# EAGLE design R3Mkr12F_Solar (EAGLE 9.0.1)
CREV: 0.9

## Sheet 1 of 2
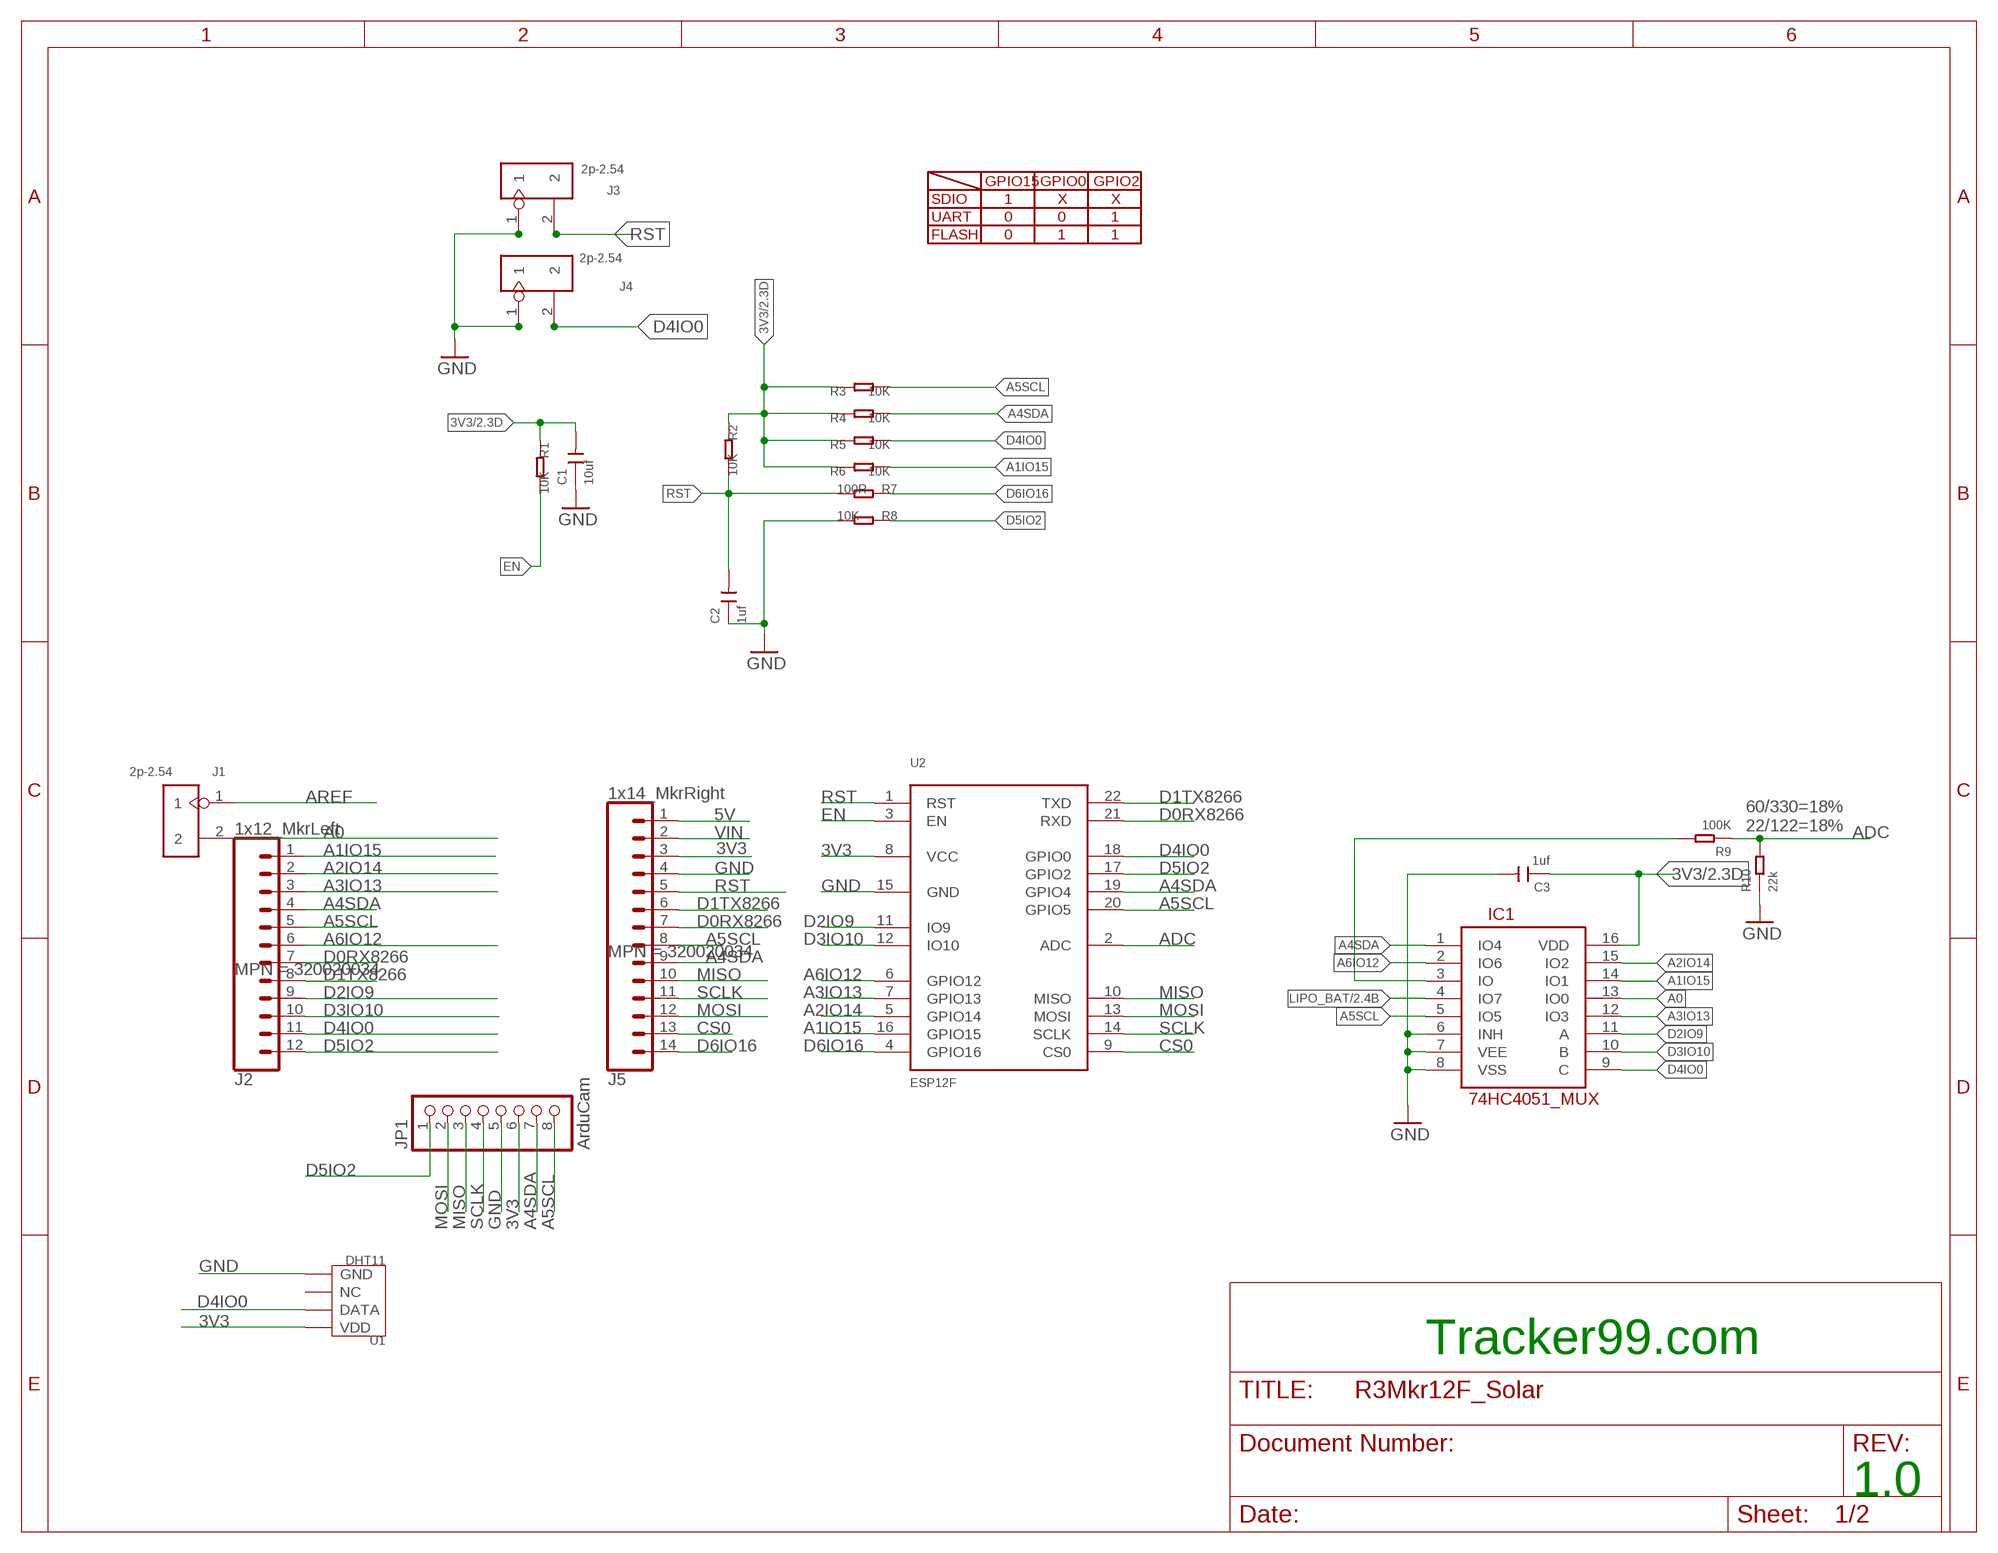
[diagram p0: schematic, sheet 1]
FRAME1 (FRAME_A_L): AUTHOR: jimmy; CREV: 1; DOC_NUMBER: 111; REVISION: 1.0

### Parts
C1  10uf  CERAMIC-10UF-10V-10%-X5R(0603)  [C0603]
C2  1uf  CERAMIC-1UF-25V-10%-X7R(0603)  [C0603]
C3  1uf  CERAMIC-1UF-25V-10%-X7R(0603)  [C0603]
IC1  74HC4051_MUX  SPARKFUN_74HC4051_MUX  [SPARKFUN_SO16]
J1  2p-2.54  DIP-BLACK-ROUND-FEMALE-HEADER-VERT(2P-2.54)  [H2-2.54]
J2  1x12_MkrLeft  CONN_12LOCK  [1X12_LOCK]
J3  2p-2.54  DIP-BLACK-MALE-HEADER-VERT(2P-2.54)  [H2-2.54]
J4  2p-2.54  DIP-BLACK-MALE-HEADER-VERT(2P-2.54)  [H2-2.54]
J5  1x14_MkrRight  CONN_14LOCK  [1X14_LOCK]
JP1  ArduCam  MILLER_PINHD-1X8LOCK  [MILLER_1X08-LOCK]
R1  10K  SEEED-RESISTOR_SMD-RES-10K-5%-1/(0402)  [SEEED-RESISTOR_R0402]
R2  10K  SEEED-RESISTOR_SMD-RES-10K-5%-1/(0402)  [SEEED-RESISTOR_R0402]
R3  10K  SEEED-RESISTOR_SMD-RES-10K-5%-1/(0402)  [SEEED-RESISTOR_R0402]
R4  10K  SEEED-RESISTOR_SMD-RES-10K-5%-1/(0402)  [SEEED-RESISTOR_R0402]
R5  10K  SEEED-RESISTOR_SMD-RES-10K-5%-1/(0402)  [SEEED-RESISTOR_R0402]
R6  10K  SEEED-RESISTOR_SMD-RES-10K-5%-1/(0402)  [SEEED-RESISTOR_R0402]
R7  100R  SMD-RES-100R-5%-1/10W(0603)  [R0603]
R8  10K  SEEED-RESISTOR_SMD-RES-10K-5%-1/(0402)  [SEEED-RESISTOR_R0402]
R9  100K  SMD-RES-100K-1%-1/16W(0402)  [R0402]
R10  22k  SMD-RES-22K-1%-1/16W(0402)  [R0402]
U1  DHT11  TEM-HUM-DHT11(4P-15.5X12.0MM)  [SNR4-2.54-15.5X12.0X5.5MM]
U2  ESP12F  ESP-12F  [ESP-12F]

### Nets
3V3 [POWER]: C1.2 C3.1 IC1.16(VDD) J5.3 JP1.6 R1.1 R2.1 R3.1 R4.1 R5.1 R6.1 U1.1(VDD) U2.8(VCC) ; also sheet 2
5V [POWER]: J5.1 ; also sheet 2
A0: IC1.13(IO0) J1.2
A1IO15: IC1.14(IO1) J2.1 R6.2 U2.16(GPIO15)
A2IO14: IC1.15(IO2) J2.2 U2.5(GPIO14)
A3IO13: IC1.12(IO3) J2.3 U2.7(GPIO13)
A4SDA: IC1.1(IO4) J2.4 J5.9 JP1.7 R4.2 U2.19(GPIO4)
A5SCL: IC1.5(IO5) J2.5 J5.8 JP1.8 R3.2 U2.20(GPIO5)
A6IO12: IC1.2(IO6) J2.6 U2.6(GPIO12)
ADC: R9.1 R10.2 U2.2(ADC)
AREF: J1.1
CS0: J5.13 U2.9(CS0)
D0RX8266: J2.7 J5.7 U2.21(RXD)
D1TX8266: J2.8 J5.6 U2.22(TXD)
D2IO9: IC1.11(A) J2.9 U2.11(IO9)
D3IO10: IC1.10(B) J2.10 U2.12(IO10)
D4IO0: IC1.9(C) J2.11 J4.2 R5.2 U1.2(DATA) U2.18(GPIO0)
D5IO2: J2.12 JP1.1 R8.1 U2.17(GPIO2)
D6IO16: J5.14 R7.1 U2.4(GPIO16)
EN: R1.2 U2.3(EN)
GND [POWER]: C1.1 C2.1 C3.2 IC1.6(INH) IC1.7(VEE) IC1.8(VSS) J3.1 J4.1 J5.4 JP1.5 R8.2 R10.1 U1.4(GND) U2.15(GND) ; also sheet 2
LIPO_BAT [POWER]: IC1.4(IO7) ; also sheet 2
MISO: J5.10 JP1.3 U2.10(MISO)
MOSI: J5.12 JP1.2 U2.13(MOSI)
RST: C2.2 J3.2 J5.5 R2.2 R7.2 U2.1(RST)
SCLK: J5.11 JP1.4 U2.14(SCLK)
VIN: J5.2
Z: IC1.3(IO) R9.2
Unconnected: U1.3(NC)

### Notes on the sheet
- GPIO15 | GPIO0 | GPIO2
- SDIO | 1 | X | X
- UART | 0 | 0 | 1
- FLASH | 0 | 1 | 1
- 60/330=18%
  22/122=18%
- Tracker99.com
- 1.0

## Sheet 2 of 2
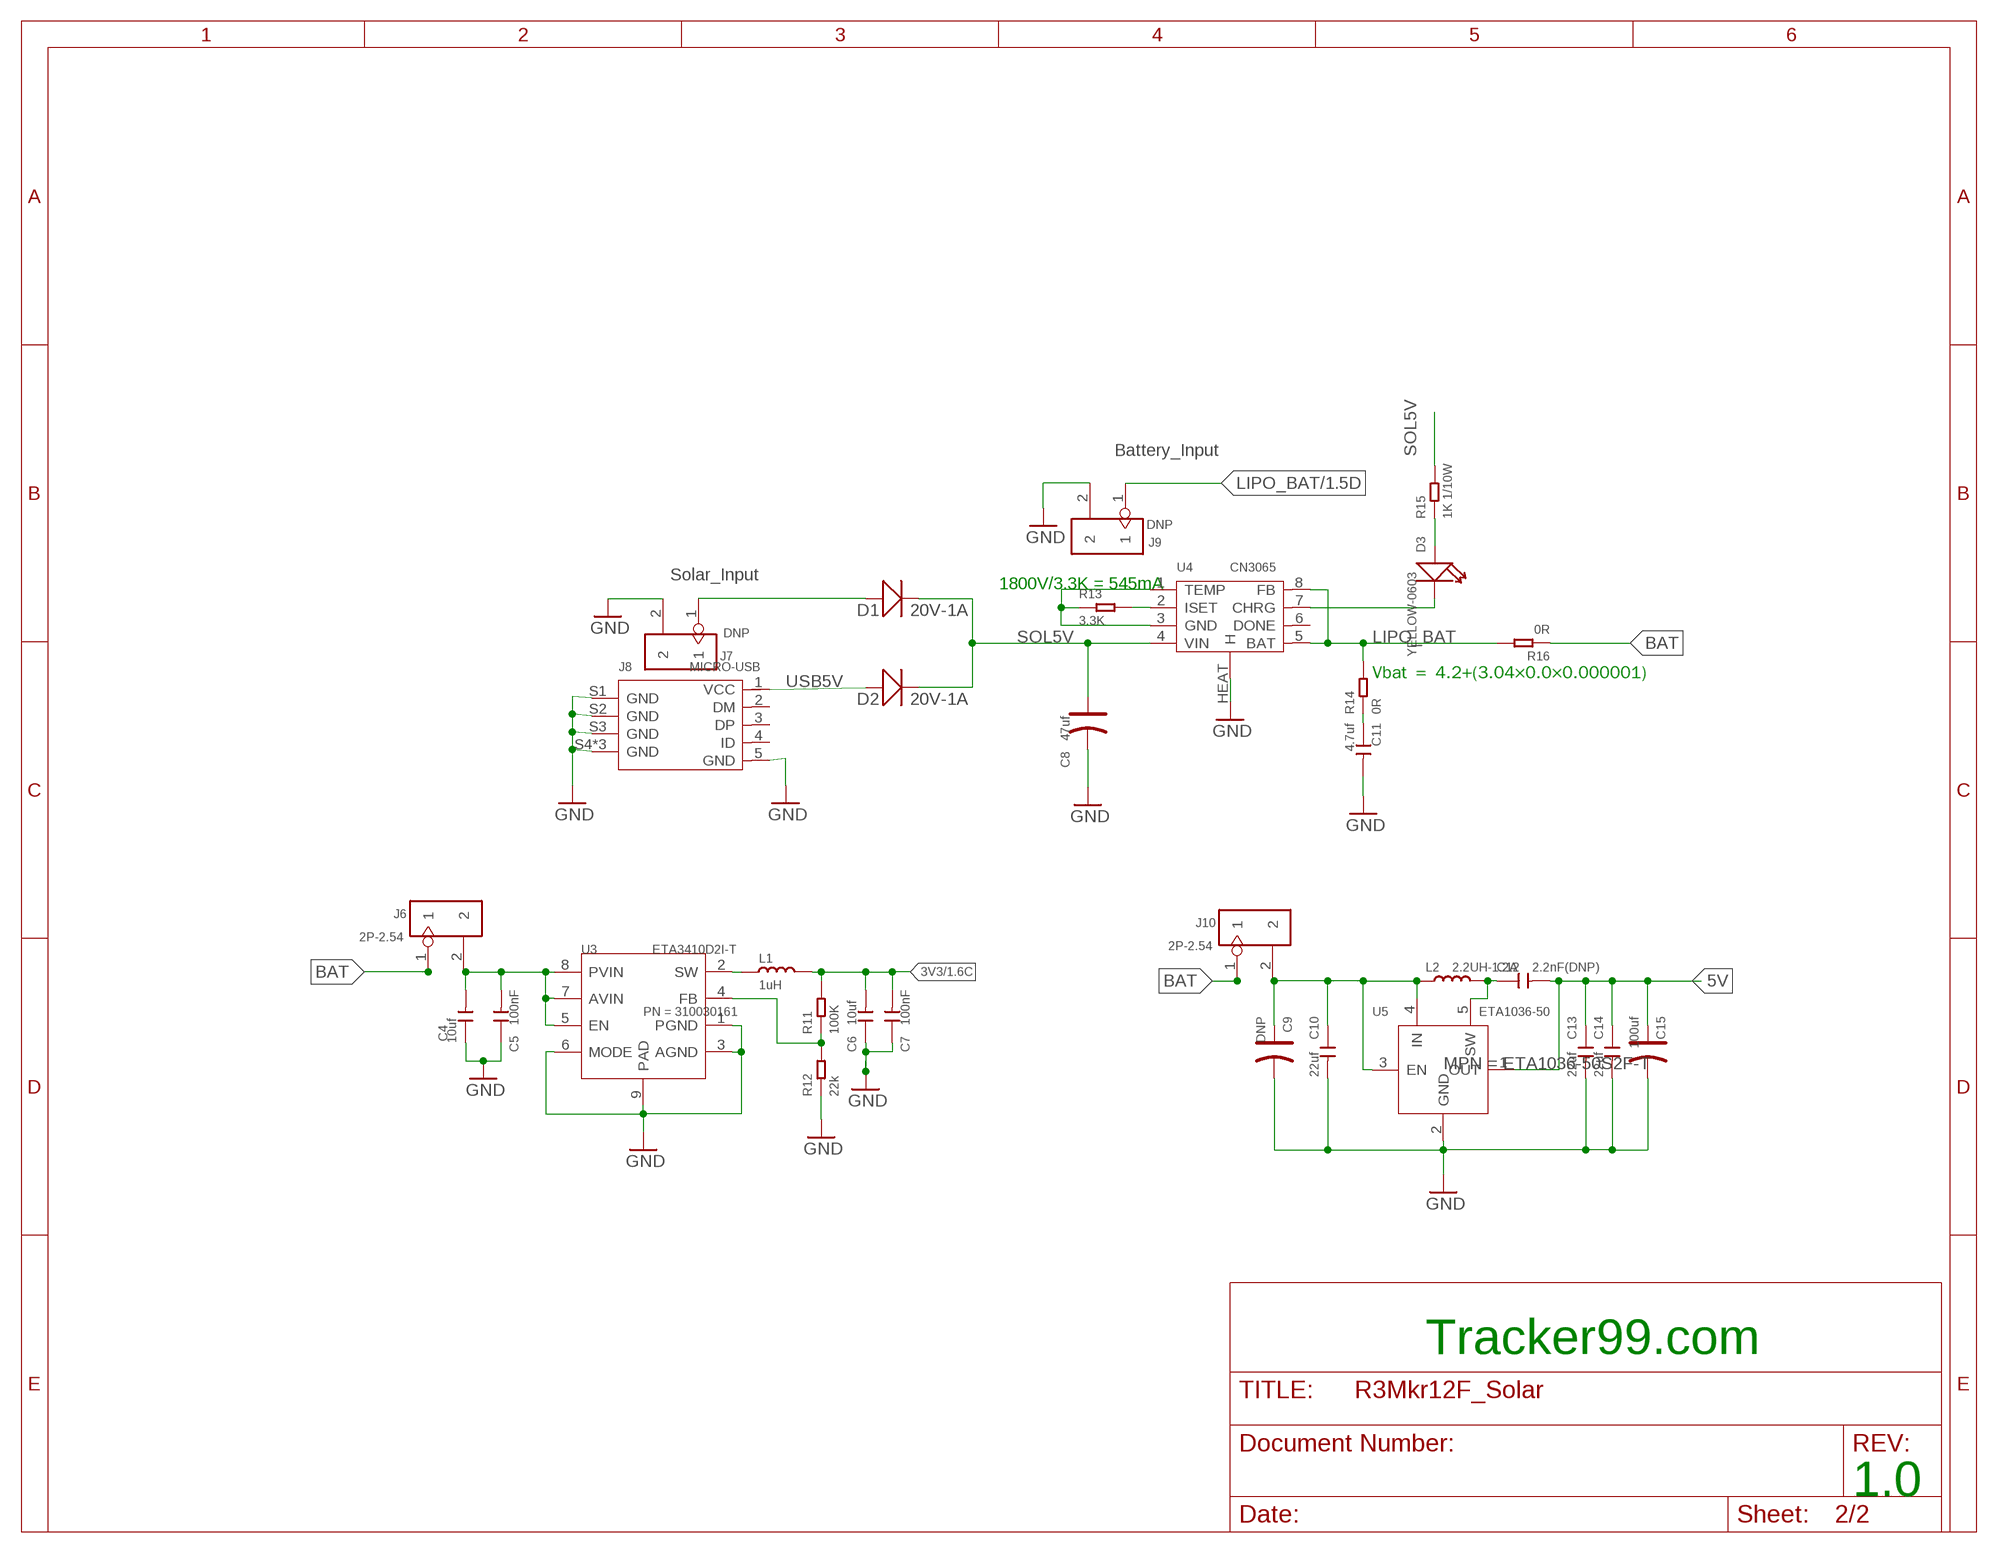
[diagram p1: schematic, sheet 2]

### Parts
C4  10uf  CERAMIC-10UF-25V-10%-X5R(0805)  [C0805]
C5  100nF  CAP-0402  [C0402]
C6  10uf  CERAMIC-10UF-25V-10%-X5R(0805)  [C0805]
C7  100nF  CAP-0402  [C0402]
C8  47uf  TANTALUM-SMD-47UF-6.3V(AVX-A)  [AVX-A]
C9  DNP  CAP_AVX_B  [AVX-B]
C10  22uf  CERAMIC-22UF-6.3V-20%-X5R(0805)  [C0805]
C11  4.7uf  CERAMIC-4.7UF-10V-10%-X5R(0603)  [C0603]
C12  2.2nF(DNP)  C-0603  [C0603]
C13  22uf  CERAMIC-22UF-6.3V-20%-X5R(0805)  [C0805]
C14  22uf  CERAMIC-22UF-6.3V-20%-X5R(0805)  [C0805]
C15  100uf  TANTALUM-SMD-100UF-10V(AVX-B)  [AVX-B]
D1  20V-1A  SMD-DIODE-SCHOTTKY-20V-1A(SOD-123)  [SOD-123]
D2  20V-1A  SMD-DIODE-SCHOTTKY-20V-1A(SOD-123)  [SOD-123]
D3  YELLOW-0603  SMD-LED-CLEAR-YELLOW(0603)  [LED-0603]
J6  2P-2.54  DIP-WHITE-MALE-HEADER-VERT(2P-2.54)  [H2-2.54]
J7  DNP  DIP-WHITE-MALE-HEADER-VERT(2P-2.54)  [H2-2.54]
J8  MICRO-USB  MICRO-USB5+4P'5+4P'  [MICRO-USB5+4P-SMD-0.65-B]
J9  DNP  DIP-WHITE-MALE-HEADER-VERT(2P-2.54)  [H2-2.54]
J10  2P-2.54  DIP-WHITE-MALE-HEADER-VERT(2P-2.54)  [H2-2.54]
L1  1uH  INDUCTOR/FERRITE-BEAD'0603'  [L0603]
L2  2.2UH-1.2A  SMD-INDUCTOR-2.2UH-20%-1.2A(0805)  [L0805]
R11  100K  SMD-RES-100K-1%-1/16W(0402)  [R0402]
R12  22k  SMD-RES-22K-1%-1/16W(0402)  [R0402]
R13  3.3K  SMD-RES-3.3K-5%-1/10W(0603)  [R0603]
R14  0R  SMD-RES-0R-5%-1/10W(0603)  [R0603]
R15  1K 1/10W  SMD-RES-1K-5%-1/10W(0603)  [R0603]
R16  0R  SMD-RES-0R-5%-1/10W(0603)  [R0603]
U3  ETA3410D2I-T  CONVERTER-ETA3410  [DFN8G-0.5-2X2MM]
U4  CN3065  PMIC-CN3065-DFN8  [DFN-8]
U5  ETA1036-50  ETA1036  [SOT23-5]

### Nets
3V3 [POWER]: C6.2 C7.2 L1.2 R11.2 ; also sheet 1
5V [POWER]: C12.2 C13.1 C14.1 C15.+ U5.1(OUT) ; also sheet 1
BAT [POWER]: J6.1 J10.1 R16.1
BAT_3V3_IN [POWER]: C4.2 C5.2 J6.2 U3.5(EN) U3.7(AVIN) U3.8(PVIN)
BAT_IN [POWER]: C9.+ C10.1 J10.2 L2.1 U5.3(EN) U5.4(IN)
GND [POWER]: C4.1 C5.1 C6.1 C7.1 C8.- C9.- C10.2 C11.2 C13.2 C14.2 C15.- J7.2 J8.5(GND) J8.S1(GND) J8.S2(GND) J8.S3(GND) J8.S4(GND) J8.S5(GND) J8.S6(GND) J9.2 R12.1 R13.1 U3.1(PGND) U3.3(AGND) U3.6(MODE) U3.9(PAD) U4.1(TEMP) U4.3(GND) U4.HEAT(H) U5.2(GND) ; also sheet 1
LIPO_BAT [POWER]: J9.1 R14.2 R16.2 U4.5(BAT) U4.8(FB) ; also sheet 1
N$1 [POWER]: D1.+ J7.1
N$2: D3.+ R15.1
N$3: L1.1 U3.2(SW)
N$4: R11.1 R12.2 U3.4(FB)
N$7: R13.2 U4.2(ISET)
N$8: D3.- U4.7(CHRG)
N$10: C11.1 R14.1
N$11: C12.1 L2.2 U5.5(SW)
SOL5V [POWER]: C8.+ D1.- D2.- R15.2 U4.4(VIN)
USB5V [VUSB]: D2.+ J8.1(VCC)
Unconnected: J8.2(DM) J8.3(DP) J8.4(ID) U4.6(DONE)

### Notes on the sheet
- Battery_Input
- Solar_Input
- 1800V/3.3K = 545mA
- Vbat ＝ 4.2+(3.04×0.0×0.000001)
- Tracker99.com
- 1.0

## Library data of the parts
C1 = Seeed-Capacitor:CERAMIC-10UF-10V-10%-X5R(0603): 302010103; MPN: CC0603KRX5R6BB106
C2 C3 = Seeed-Capacitor:CERAMIC-1UF-25V-10%-X7R(0603): 302010139; MPN: CC0603KRX7R8BB105
C4 C6 = Seeed-Capacitor:CERAMIC-10UF-25V-10%-X5R(0805): 302010178; MPN: CC0805KKX5R8BB106; PN: 302010178
C5 C7 = Discrete-new:CAP: Ceramic Capacitors; PN: 302010004
C8 = Seeed-Capacitor:TANTALUM-SMD-47UF-6.3V(AVX-A): 302020005; MPN: TAJA476*006#NJ
C9 = discrete:CAP*: Electrolytic Capacitors,Tantalum Capacitors and Super Capacitors
C10 C13 C14 = Seeed-Capacitor:CERAMIC-22UF-6.3V-20%-X5R(0805): 302010171; MPN: CC0805MKX5R5BB226
C11 = Seeed-Capacitor:CERAMIC-4.7UF-10V-10%-X5R(0603): 302010111; MPN: CC0603KRX5R6BB475
C12 = discrete:C*: Ceramic Capacitors
C15 = Seeed-Capacitor:TANTALUM-SMD-100UF-10V(AVX-B): 302020015; MPN: TAJB107M010#NJ
D1 D2 = Seeed-OPL-2017-01-Diode-james:SMD-DIODE-SCHOTTKY-20V-1A(SOD-123): 304020034; MPN: B5819W
D3 = Seeed-LED:SMD-LED-CLEAR-YELLOW(0603): 304090044; MPN: 19-217-Y5C-AM1N1VY-3T
IC1 = Mkr4_12F:SPARKFUN_74HC4051_MUX
J1 = Seeed-Connector:DIP-BLACK-ROUND-FEMALE-HEADER-VERT(2P-2.54): 320030050; MPN: RF130-1023ABS0741
J2 = SparkFun-Connectors:CONN_12: Multi connection point. Often used as Generic Header-pin footprint for 0.1 inch spaced/style header connections On any of the 0.1 inch spaced packages, you can populate with these: Break Away Headers - Straight <https://www.sparkfun.com/products/116> (PRT-00116) Break Away Male Headers - Right Angle <https://www.sparkfun.com/products/553> (PRT-00553) Female Headers <https://www.sparkfun.com/products/115> (PRT-00115) Break Away Headers - Machine Pin <https://www.sparkfun.com/products/117> (PRT-00117) Break Away Female Headers - Swiss Machine Pin <https://www.sparkfun.com/products/743> (PRT-00743) For SCREWTERMINALS and SPRING TERMINALS visit here: Screw Terimnals on SparkFun.com <https://www.sparkfun.com/search/results?term=Screw+Terminals> (5mm/3.5mm/2.54mm spacing) This device is also useful as a general connection point to wire up your design to another part of your project. Our various solder wires solder well into these plated through hole pads. Hook-Up Wire - Assortment (Stranded, 22 AWG) <https://www.sparkfun.com/products/11375> (PRT-11375) Hook-Up Wire - Assortment (Solid Core, 22 AWG) <https://www.sparkfun.com/products/11367> (PRT-11367) View the entire wire category on our website here <https://www.sparkfun.com/categories/141> Special notes: Molex polarized connector foot print use with SKU : PRT-08231 with associated crimp pins and housings. 1MM SMD Version SKU: PRT-10208 NOTES ON THE VARIANTS LOCK and LOCK_LONGPADS... This footprint was designed to help hold the alignment of a through-hole component (i.e. 6-pin header) while soldering it into place. You may notice that each hole has been shifted either up or down by 0.005 of an inch from it's more standard position (which is a perfectly straight line). This slight alteration caused the pins (the squares in the middle) to touch the edges of the holes. Because they are alternating, it causes a "brace" to hold the component in place. 0.005 has proven to be the perfect amount of "off-center" position when using our standard breakaway headers. Although looks a little odd when you look at the bare footprint, once you have a header in there, the alteration is very hard to notice. Also,if you push a header all the way into place, it is covered up entirely on the bottom side.; MPN: 320020034
J3 J4 = Seeed-Connector:DIP-BLACK-MALE-HEADER-VERT(2P-2.54): 320020016; MPN: P125-1102A0BS116A1
J5 = SparkFun-Connectors:CONN_14: Multi connection point. Often used as Generic Header-pin footprint for 0.1 inch spaced/style header connections On any of the 0.1 inch spaced packages, you can populate with these: Break Away Headers - Straight <https://www.sparkfun.com/products/116> (PRT-00116) Break Away Male Headers - Right Angle <https://www.sparkfun.com/products/553> (PRT-00553) Female Headers <https://www.sparkfun.com/products/115> (PRT-00115) Break Away Headers - Machine Pin <https://www.sparkfun.com/products/117> (PRT-00117) Break Away Female Headers - Swiss Machine Pin <https://www.sparkfun.com/products/743> (PRT-00743) For SCREWTERMINALS and SPRING TERMINALS visit here: Screw Terimnals on SparkFun.com <https://www.sparkfun.com/search/results?term=Screw+Terminals> (5mm/3.5mm/2.54mm spacing) This device is also useful as a general connection point to wire up your design to another part of your project. Our various solder wires solder well into these plated through hole pads. Hook-Up Wire - Assortment (Stranded, 22 AWG) <https://www.sparkfun.com/products/11375> (PRT-11375) Hook-Up Wire - Assortment (Solid Core, 22 AWG) <https://www.sparkfun.com/products/11367> (PRT-11367) View the entire wire category on our website here <https://www.sparkfun.com/categories/141> Special notes: Molex polarized connector foot print use with SKU : PRT-08231 with associated crimp pins and housings. 1MM SMD Version SKU: PRT-10208 NOTES ON THE VARIANTS LOCK and LOCK_LONGPADS... This footprint was designed to help hold the alignment of a through-hole component (i.e. 6-pin header) while soldering it into place. You may notice that each hole has been shifted either up or down by 0.005 of an inch from it's more standard position (which is a perfectly straight line). This slight alteration caused the pins (the squares in the middle) to touch the edges of the holes. Because they are alternating, it causes a "brace" to hold the component in place. 0.005 has proven to be the perfect amount of "off-center" position when using our standard breakaway headers. Although looks a little odd when you look at the bare footprint, once you have a header in there, the alteration is very hard to notice. Also,if you push a header all the way into place, it is covered up entirely on the bottom side.; MPN: 320020034
J6 J10 = Seeed-Connector:DIP-WHITE-MALE-HEADER-VERT(2P-2.54): 320020037; MPN: P125-1102A0BS116A3
J7 J9 = Seeed-Connector:DIP-WHITE-MALE-HEADER-VERT(2P-2.54): 320020037; MPN: P125-1102A0BS116A3; VALUE: 2P-2.54
J8 = Connector-new:MICRO-USB5+4P: 5+4P-SMD-0.65-B:320010000;5+2P-SMD-0.65-AB:340032001; EAGLEUP: USB-MICROB;2.54mm
JP1 = MKR12FUNO99:MILLER_PINHD-1X8: PIN HEADER
L1 = Discrete-new:INDUCTOR/FERRITE-BEAD; PN: 303010110
L2 = Seeed-Inductor:SMD-INDUCTOR-2.2UH-20%-1.2A(0805): 303010086; MPN: LQM2MPN2R2MG0
R1-R6 R8 = R3Mkr12F_Solar:SEEED-RESISTOR_SMD-RES-10K-5%-1/(0402): 301010004; MPN: RC0402JR-0710KL
R7 = Seeed-Resistor:SMD-RES-100R-5%-1/10W(0603): 301010090; MPN: RC0603JR-07100RL
R9 R11 = Seeed-Resistor:SMD-RES-100K-1%-1/16W(0402): 301010456; MPN: RC0402FR-07100KL; PN: 301010666
R10 R12 = Seeed-Resistor:SMD-RES-22K-1%-1/16W(0402); MPN: RC0402FR-0722KL
R13 = Seeed-Resistor:SMD-RES-3.3K-5%-1/10W(0603): 301010112
R14 R16 = Seeed-Resistor:SMD-RES-0R-5%-1/10W(0603): 301010292; MPN: RC0603JR-070RL
R15 = Seeed-Resistor:SMD-RES-1K-5%-1/10W(0603): 301010291; MPN: RC0603JR-071KL
U1 = Seeed-Sensor:TEM-HUM-DHT11(4P-15.5X12.0MM): 314010000; MPN: DHT11
U2 = Seeed-OPL-2017-01-Sensor-camilo:ESP-12F: 317060163
U3 = template:CONVERTER-ETA3410: 3MHZ 2A High Step-Down Converter in DFN2x2-8L Package; PN: 310030161
U4 = IC-new:PMIC-CN3065: 310030101
U5 = IC:ETA1036; MPN: ETA1036-50S2F-T

## Net classes
0 default: width 0.152 mm, drill 0.152 mm, clearance 0.152 mm
1 POWER: width 0.305 mm, clearance 0.152 mm
2 VUSB: width 0.305 mm, drill 0.254 mm, clearance 0.203 mm

## Board
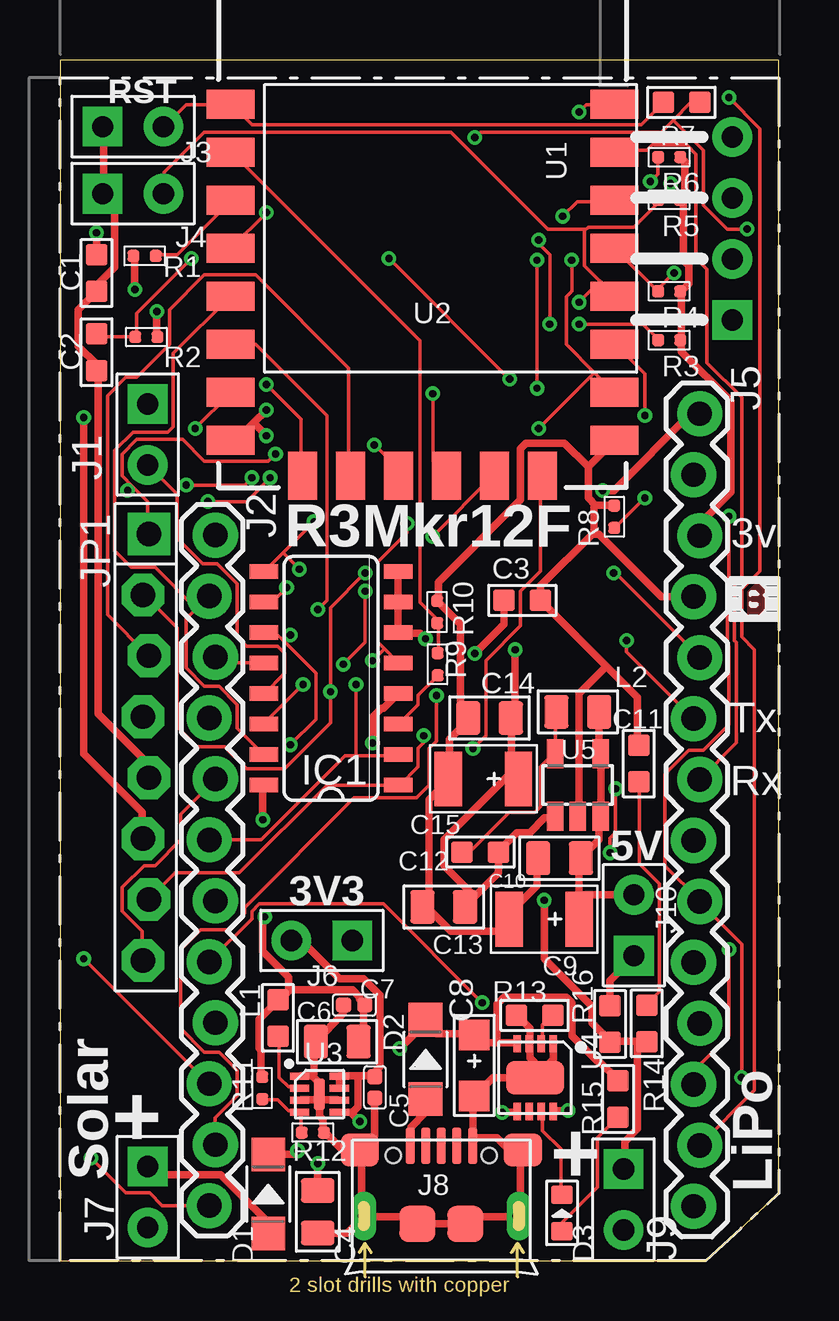
[diagram p2: board, top side]
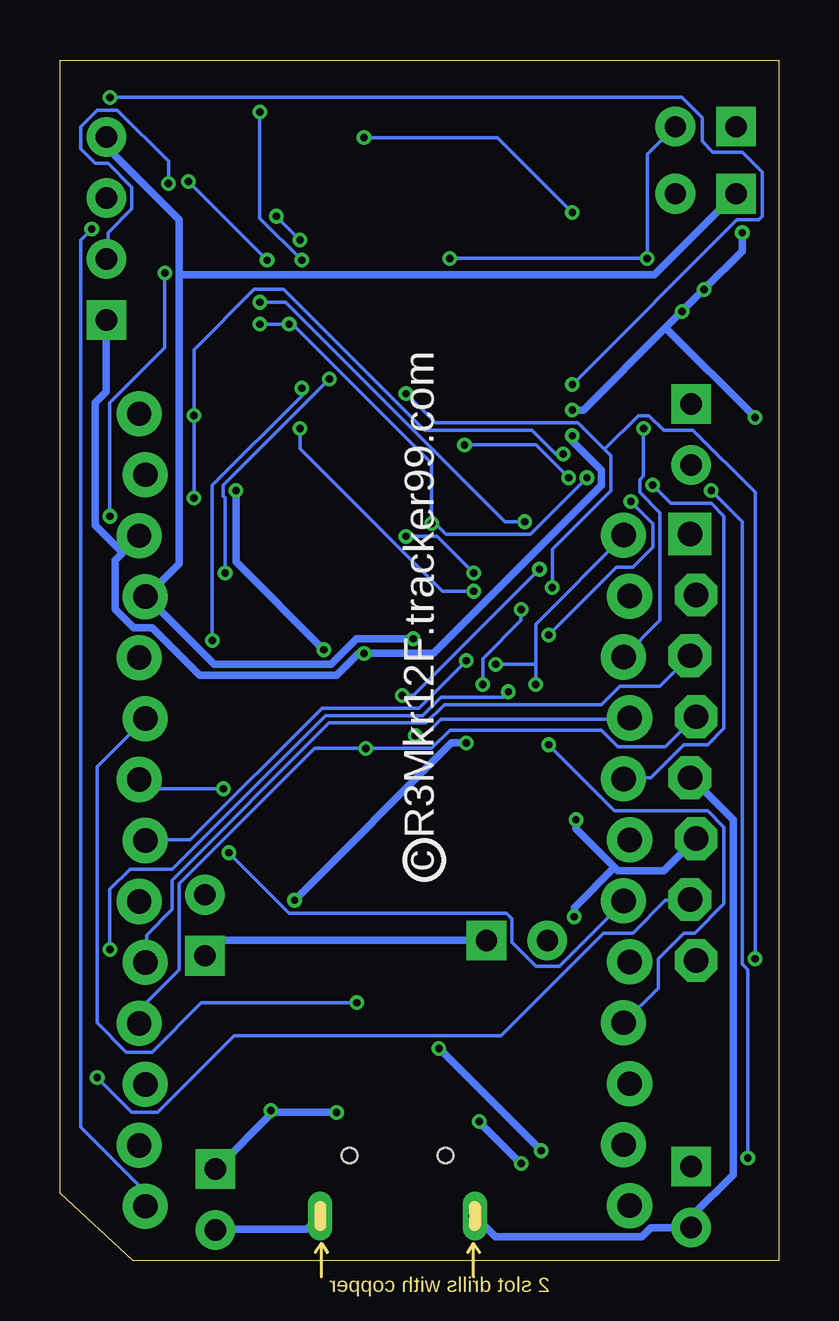
[diagram p3: board, bottom side, seen from below]

Size 29.97 x 50.02 mm. Coordinates in mm from the lower left corner, seen from the top.
Outline: 29.97,50.02 0,50.02 0,0 26.92,0 29.97,2.79 29.97,50.02
Copper layers (1*16): Top 0.035mm / dielectric 1.5mm / Bottom 0.035mm
Design rules "SeeedStudio_2layer_DRU_no_angle_20140221 *": minimum track width 6mil, minimum drill 12mil, track to track 6mil, track to pad 6mil, pad to pad 6mil, via to via 6mil, smd to smd 0mil, copper to edge 10mil, drill to drill 10mil, minimum pad ring 6mil, minimum via ring 6mil, stop-mask expansion 2mil, vias tented up to drill 100mil, thermal gap 10mil
tRestrict: area 29.5,1.3 to 30.7,50.8; area -0.5,-1 to 0.5,49.8
bRestrict: area 29.2,0 to 30.5,49.5; area -1,-0.5 to 0.5,50.3

### Footprints (pad centres in the part's own frame; a part is rotated, then mirrored left to right if it is on the bottom)
C0603 = smd 0.889 x 0.889: 1 0,0.762; 2 0,-0.762
C0805 = smd 1.397 x 1.016: 1 0,0.889; 2 0,-0.889
C0402 = smd 0.635 x 0.635: 1 0,0.445; 2 0,-0.445
AVX-A = smd 1.27 x 1.27: + -1.27,0; - 1.27,0
AVX-B = smd 1.143 x 2.286: + -1.46,0; - 1.46,0
C0603' = smd 0.889 x 0.889: 1 -0.762,0; 2 0.762,0
SOD-123 = smd 1.397 x 1.397: + -1.651,0; - 1.651,0
LED-0603 = smd 0.762 x 0.889: + -0.762,0; - 0.762,0
SPARKFUN_SO16 = smd 0.6 x 1.2: 1 -4.445,-2.8; 2 -3.175,-2.8; 3 -1.905,-2.8; 4 -0.635,-2.8; 5 0.635,-2.8; 6 1.905,-2.8; 7 3.175,-2.8; 8 4.445,-2.8; 9 4.445,2.8; 10 3.175,2.8; 11 1.905,2.8; 12 0.635,2.8; 13 -0.635,2.8; 14 -1.905,2.8; 15 -3.175,2.8; 16 -4.445,2.8
H2-2.54 = drill 0.889 pad 1.651 square: 1 0,1.27 | drill 0.889 pad 1.651: 2 0,-1.27
1X12_LOCK = drill 1.016 pad 1.88: 1 0,0.127; 2 2.54,-0.127; 3 5.08,0.127; 4 7.62,-0.127; 5 10.16,0.127; 6 12.7,-0.127; 7 15.24,0.127; 8 17.78,-0.127; 9 20.32,0.127; 10 22.86,-0.127; 11 25.4,0.127; 12 27.94,-0.127
1X14_LOCK = drill 1.016 pad 1.88: 1 0,0.127; 2 2.54,-0.127; 3 5.08,0.127; 4 7.62,-0.127; 5 10.16,0.127; 6 12.7,-0.127; 7 15.24,0.127; 8 17.78,-0.127; 9 20.32,0.127; 10 22.86,-0.127; 11 25.4,0.127; 12 27.94,-0.127; 13 30.48,0.127; 14 33.02,-0.127
MICRO-USB5+4P-SMD-0.65-B = smd 0.381 x 1.524: 1 -1.3,-0.25; 2 -0.65,-0.25; 3 0,-0.25; 4 0.65,-0.25; 5 1.3,-0.25 | smd 1.6 x 1.397: S1 -3.4,-0.427; S6 3.4,-0.427 | drill 0.508 pad 1.016 long: S2 -3.226,-3.175; S5 3.226,-3.175 | smd 1.5 x 1.5: S3 -1,-3.5; S4 1,-3.5 | hole 0.635: -2,-0.65; 2,-0.65
MILLER_1X08-LOCK = drill 1.016 pad 1.778 square: 1 -8.89,0.127 | drill 1.016 pad 1.778 octagon: 2 -6.35,-0.127; 3 -3.81,0.127; 4 -1.27,-0.127; 5 1.27,0.127; 6 3.81,-0.127; 7 6.35,0.127; 8 8.89,-0.127
L0603 = smd 0.889 x 0.889: 1 -0.762,0; 2 0.762,0
L0805 = smd 1.016 x 1.397: 1 -0.889,0; 2 0.889,0
SEEED-RESISTOR_R0402 = smd 0.5 x 0.5: 1 0,0.463; 2 0,-0.463
R0603 = smd 0.889 x 0.889: 1 0,0.762; 2 0,-0.762
R0402 = smd 0.5 x 0.5: 1 0,0.463; 2 0,-0.463
SNR4-2.54-15.5X12.0X5.5MM = drill 0.889 pad 1.651 square: 1 -11.75,3.81 | drill 0.889 pad 1.651: 2 -11.75,1.27; 3 -11.75,-1.27; 4 -11.75,-3.81
ESP-12F = smd 2 x 1.2: 1 -8,3.48; 2 -8,1.48; 3 -8,-0.52; 4 -8,-2.52; 5 -8,-4.52; 6 -8,-6.52; 7 -8,-8.52; 8 -8,-10.52; 15 8,-10.52; 16 8,-8.52; 17 8,-6.52; 18 8,-4.52; 19 8,-2.52; 20 8,-0.52; 21 8,1.48; 22 8,3.48 | smd 1.2 x 2: 9 -5,-12; 10 -3,-12; 11 -1,-12; 12 1,-12; 13 3,-12; 14 5,-12
DFN8G-0.5-2X2MM = smd 0.8 x 0.3: 1 -0.827,0.75; 2 -0.827,0.25; 3 -0.827,-0.25; 4 -0.827,-0.75; 5 0.827,-0.75; 6 0.827,-0.25; 7 0.827,0.25; 8 0.827,0.75 | smd 0.45 x 1.3: 9 0,0
DFN-8 = smd 0.3 x 0.727: 1 -0.75,-1.413; 2 -0.25,-1.413; 3 0.25,-1.413; 4 0.75,-1.413; 5 0.75,1.413; 6 0.25,1.413; 7 -0.25,1.413; 8 -0.75,1.413 | smd 2.413 x 1.397: HEAT 0,0
SOT23-5 = smd 0.69 x 1.2: 1 -0.95,-1.3; 2 0,-1.3; 3 0.95,-1.3; 4 0.95,1.3; 5 -0.95,1.3

### Placement (x,y rotation side)
C1  1.52,41.15 180 top
C2  1.52,37.85 180 top
C3  19.28,27.51 90 top
C4  10.74,2.03 180 top
C5  13.13,7.21 180 top
C6  11.56,9.12 90 top
C7  12.27,10.64 90 top
C8  17.27,8.13 270 top
C9  20.19,14.22 180 top
C10  20.83,16.76 270 top
C11  24.13,20.7 180 top
C12  2.2nF(DNP)  [C0603']  17.53,17.02 0 top
C13  16,14.73 270 top
C14  17.91,22.61 270 top
C15  17.65,20.07 180 top
D1  8.69,2.77 90 top
D2  15.24,8.38 90 top
D3  20.93,1.98 90 top
IC1  11.3,24.26 90 top
J1  3.66,34.42 0 top
J2  6.35,30.23 270 top
J3  3.05,47.24 90 top
J4  3.05,44.45 90 top
J5  26.54,35.28 270 top
J6  10.92,13.34 270 top
J7  3.66,2.64 0 top
J8  15.9,5.03 0 top
J9  23.5,2.54 0 top
J10  23.93,13.97 180 top
JP1  3.58,21.39 270 top
L1  9.09,10.11 90 top
L2  21.59,22.86 180 top
R1  3.53,41.86 90 top
R2  3.61,38.48 270 top
R3  25.4,38.35 270 top
R4  25.4,40.39 270 top
R5  25.4,44.2 270 top
R6  25.4,45.97 270 top
R7  25.91,48.26 270 top
R8  23.11,30.99 180 top
R9  15.75,24.84 0 top
R10  15.72,27.03 0 top
R11  8.43,7.19 180 top
R12  10.54,5.33 270 top
R13  19.79,10.21 90 top
R14  24.46,9.88 0 top
R15  23.27,6.73 180 top
R16  22.94,9.86 0 top
U1  16.28,43 180 top
U2  15.11,44.7 0 top
U3  10.82,6.93 0 top
U4  19.81,7.62 180 top
U5  21.59,19.81 0 top

### Tracks (layer width: path | path; a pad name or v marks a point on that pad's centre or on a via)
3V3  (via drill 0.3)
  Top 0.305: C6.2 12.5,9.14 12.65,9.3 12.65,10.59 C7.2 12.65,10.74 12.5,10.9 12.5,10.97 12.19,11.28 9.6,11.28 | R11.2 8.38,7.7 8.38,8.76 8.31,8.84 8.31,10.06 9.07,10.82 L1.2 9.22,10.9 9.6,11.28 | v8.46,18.36 8.46,19.81 IC1.16 | v8.53,14.33 8.46,14.25 8.46,12.88 9.53,11.81 9.53,11.35 9.6,11.28 | v4.04,39.55 4.04,38.48 R2.1 | v3.12,40.46 3.12,41.83 R1.1 | v1.52,42.82 C1.2 | v8.61,35.43 8.08,34.9 | 8.08,34.9 7.39,34.21 7.16,34.21 U2.8 | R6.1 25.91,45.95 26.06,45.8 26.06,44.58 25.91,44.42 25.91,44.2 R5.1 25.98,44.12 25.98,41.68 26.21,41.45 26.21,40.69 25.98,40.46 R4.1 25.91,40.39 25.91,38.41 R3.1 25.91,38.25 25.91,37.87 27.96,35.81 27.96,32 26.67,30.71 J5.3 | C3.1 18.52,26.52 v17.3,25.3 | v8.61,34.37 8.08,34.9 | v0.99,35.13 0.99,21.11 3.43,18.67 3.43,17.6 JP1.6
  Bottom 0.305: v8.46,18.36 8.46,17.98 6.86,16.38 | 6.86,16.38 6.71,16.23 4.8,16.23 JP1.6 | v8.53,14.33 8.53,14.71 6.86,16.38 | v1.52,42.82 1.52,42.06 v3.12,40.46 v4.04,39.55 4.72,38.86 | v8.61,35.43 8.15,35.43 4.72,38.86 | 27.36,29.49 26.67,30.18 J5.3 | 27.36,29.49 27.66,29.18 27.66,27.13 26.9,26.36 26.14,26.36 24.16,24.38 18.44,24.38 17.53,25.3 v17.3,25.3 14.4,25.3 7.39,32.31 7.39,32.92 8.61,34.14 v8.61,34.37 | 27.36,29.49 28.5,30.63 28.5,35.74 28.04,36.2 28.04,39.17 U1.1 | 4.72,38.86 v0.99,35.13
5V  (via drill 0.3)
  Top 0.305: U5.1 20.57,18.44 20.19,18.44 19.58,17.83 19.05,17.83 18.36,17.14 C12.2 18.29,16.15 16.92,14.78 C13.1 17.22,15.24 16,16.46 16,17.53 18.75,20.27 C15.+ 19.05,20.12 18.82,20.34 18.82,22.55 C14.1 18.97,22.78 v18.97,25.45 | J5.1 26.29,35.28 23.09,32.08 v22.63,32.08
  Bottom 0.305: v22.63,32.08 22.63,29.11 v18.97,25.45
A0
  Top 0.152: J1.2 4.88,31.93 4.88,30.1 5.94,29.03 6.55,29.03 7.39,28.19 7.39,25.98 7.77,25.6 9.07,25.6 9.37,25.3 9.37,24.46 8.53,23.62 IC1.13
A1IO15  (via drill 0.3)
  Top 0.152: v24.61,44.96 24.92,45.26 24.92,45.95 R6.2 | v21.34,41.68 21.34,40.39 21.11,40.16 21.11,38.18 22.29,36.99 | 22.29,36.99 23.09,36.2 U2.16 | v10.13,24 8.53,22.4 IC1.14 | v19.96,34.67 22.29,36.99 | v12.72,27.89 12.72,25.76 v11.81,24.84
  Bottom 0.152: v21.34,41.68 v24.61,44.96 | 10.13,24.84 10.13,26.52 6.48,30.18 J2.1 | 10.13,24.84 v10.13,24 | v19.96,34.67 19.96,33.83 14.02,27.89 v12.72,27.89 | 10.13,24.84 v11.81,24.84
A2IO14
  Top 0.152: IC1.15 8.46,21.11 7.39,22.17 7.39,23.16 6.63,23.93 6.02,23.93 5.26,24.69 5.26,26.75 6.17,27.66 J2.2 5.64,27.2 3.96,28.88 2.97,28.88 2.29,29.57 2.29,33.76 3.05,34.52 4.5,34.52 4.72,34.75 4.72,37.8 7.09,40.16 U2.5
A3IO13  (via drill 0.3)
  Top 0.152: J2.3 6.71,24.92 8.46,24.92 IC1.12 | v5.64,34.67 7.09,36.12 U2.7
  Bottom 0.152: v5.64,34.67 5.64,32.69 5.79,32.54 5.79,32 4.95,31.17 4.95,26.67 J2.3
A4SDA  (via drill 0.3)
  Top 0.152: JP1.7 3.73,15.09 4.8,16.15 7.47,16.15 11.12,19.81 IC1.1 14.17,19.81 14.94,20.57 14.94,21.34 15.16,21.57 v15.16,21.87 | U2.19 23.16,42.14 24.92,40.39 R4.2 24.92,40.46 v25.6,41.15 | v27.89,31.01 27.89,28.35 27.81,28.27 27.81,25.68 27.89,25.6 27.89,22.33 26.82,21.26 26.21,21.26 25.22,20.27 25.22,16.46 26.67,15.01 J5.9 26.67,14.94 28.42,13.18 v28.42,7.62
  Bottom 0.152: v15.16,21.87 14.78,21.87 14.1,22.55 6.25,22.55 J2.4 | v25.6,41.15 25.6,38.02 27.89,35.74 v27.89,31.01 | v28.42,7.62 26.98,6.17 25.91,6.17 22.71,9.37 11.58,9.37 7.32,13.64 6.1,13.64 4.72,15.01 3.73,15.01 JP1.7
A5SCL  (via drill 0.3)
  Top 0.152: JP1.8 3.43,12.5 3.43,13.72 2.59,14.55 2.59,15.54 3.5,16.46 3.96,16.46 5.03,17.53 5.03,18.59 6.48,20.04 J2.5 | v21.64,39.01 24.31,39.01 24.92,38.41 R3.2 | v14.48,30.71 14.48,30.33 13.26,29.11 13.26,25.76 13.53,25.49 | 13.53,25.49 14.1,24.92 IC1.5 | v20.95,43.51 21.57,44.12 23.09,44.12 U2.20 | v19.96,42.52 19.96,42.37 20.42,41.91 v20.42,39.01 | 13.53,25.49 v13.03,24.99 | v5.26,32.31 7.7,32.31 v8,32.61
  Bottom 0.152: v21.64,39.01 v20.42,39.01 20.27,39.01 14.48,33.22 14.48,30.86 | v19.96,42.52 v20.95,43.51 | v13.03,24.99 15.01,23.01 19.05,23.01 24.54,17.53 26.36,17.53 J5.8 | v5.26,32.31 4.5,31.55 2.82,31.55 2.29,31.01 2.29,22.17 2.97,21.49 3.96,21.49 5.33,20.12 6.48,20.12 J2.5 | v8,32.61 10.36,30.25 13.87,30.25 14.48,30.86 | 14.48,30.86 v14.48,30.71
A6IO12  (via drill 0.3)
  Top 0.152: 12.34,21.03 11.89,21.03 8.38,17.53 J2.6 | 12.34,21.03 14.1,21.03 IC1.2 | v10.74,27.13 11.12,27.51 11.12,35.2 8.15,38.18 7.16,38.18 U2.6 | 12.34,21.03 v12.34,24
  Bottom 0.152: v10.74,27.13 10.74,26.67 12.34,25.07 v12.34,24
ADC
  Top 0.152: R9.1 15.77,25.38 15.77,26.52 R10.2 15.7,26.59 15.7,26.75 15.01,27.43 15.01,38.33 7.16,46.18 U2.2
BAT
  Top 0.305: R16.1 22.94,11.66 23.93,12.65 J10.1
  Bottom 0.305: J6.1 23.32,13.34 23.93,12.72 J10.1
BAT_3V3_IN  (via drill 0.3)
  Top 0.305: 12.42,7.7 11.66,7.7 U3.8 11.66,7.54 11.66,7.24 U3.7 | 12.42,7.7 13.11,7.7 C5.2 13.11,7.85 13.34,8.08 13.34,11.05 12.65,11.73 11.66,11.73 10.06,13.34 J6.2 | 12.19,6.17 U3.5 | 12.19,6.17 12.42,6.4 12.42,7.7 | v10.74,4.04 C4.2 | v12.5,5.79 12.19,6.1 12.19,6.17
  Bottom 0.305: v12.5,5.79 v10.74,4.04
BAT_IN
  Top 0.305: L2.1 22.48,21.18 U5.4 22.55,21.03 22.55,18.59 U5.3 22.48,18.44 22.48,17.53 C10.1 21.64,16.69 21.64,14.25 C9.+ 21.72,15.24 J10.2
CS0  (via drill 0.3)
  Top 0.152: v8.61,36.5 10.06,35.05 10.06,32.77 U2.9 | v27.89,48.46 29.18,47.17 29.18,28.73 28.42,27.96 28.42,25.98 28.96,25.45 28.96,7.09 J5.13
  Bottom 0.152: v8.61,36.5 1.75,43.36 0.84,43.36 0.69,43.51 0.69,45.34 1.52,46.18 2.74,46.18 3.2,46.63 3.2,47.62 4.04,48.46 v27.89,48.46
D0RX8266  (via drill 0.3)
  Top 0.152: J5.7 28.19,21.57 28.19,25.76 28.12,25.83 28.12,28.12 28.42,28.42 28.42,35.97 26.98,37.41 26.98,41.3 26.52,41.76 26.52,46.1 26.14,46.48 24.69,46.48 24.46,46.25 23.16,46.25 U2.21 | v22.94,16.99 22.94,17.6 23.16,17.83 v23.16,19.66
  Bottom 0.152: v22.94,16.99 20.42,14.48 11.35,14.48 11.12,14.25 11.12,13.26 10.13,12.27 9.14,12.27 6.48,14.94 J2.7 | v23.16,19.66 26.29,19.66 J5.7
D1TX8266  (via drill 0.3)
  Top 0.152: v21.64,47.85 21.95,48.16 23.09,48.16 U2.22 | v19.89,36.35 v19.89,41.68 | v23.62,25.83 23.62,25.38 J5.6 | v17.6,10.74 13.49,14.86 8.31,14.86 8,14.55 8,14.25 6.25,12.5 J2.8
  Bottom 0.152: v21.64,47.85 21.64,43.43 v19.89,41.68 | v19.89,36.35 19.89,36.04 23.62,32.31 v23.62,25.83 | v17.6,10.74 24.08,10.74 26.14,8.69 27.2,8.69 28.42,9.91 28.42,20.57 J5.6
D2IO9  (via drill 0.3)
  Top 0.152: 9.34,25.79 10.67,24.46 10.67,22.55 v9.6,21.49 | 9.34,25.79 8.99,26.14 8.53,26.14 IC1.11 | v13.11,33.98 14.1,32.99 14.1,32.77 U2.11 | v8.76,32.61 7.77,31.62 v6.17,31.62 | 9.34,25.79 v9.6,26.06
  Bottom 0.152: v9.6,21.49 6.86,18.75 2.97,18.75 2.29,18.06 2.29,14.86 3.5,13.64 3.96,13.64 5.03,12.57 5.03,11.35 J2.9 | v13.11,33.98 10.13,33.98 v8.76,32.61 | v6.17,31.62 5.26,30.71 5.26,29.72 6.1,28.88 6.78,28.88 v9.6,26.06
D3IO10  (via drill 0.3)
  Top 0.152: IC1.10 8.84,27.43 v9.45,28.04 | v15.54,36.12 15.54,33.3 16.08,32.77 U2.12 | v0.99,12.57 6.17,7.39 J2.10
  Bottom 0.152: v9.45,28.04 9.45,29.64 7.01,32.08 7.01,33.53 7.28,33.8 | 7.28,33.8 8.38,34.9 14.33,34.9 v15.54,36.12 | v0.99,12.57 0.99,32 3.58,34.59 4.8,34.59 5.41,35.2 5.87,35.2 7.28,33.8
D4IO0  (via drill 0.3)
  Top 0.152: 21.91,42.94 21.87,42.9 21.87,41.45 23.09,40.23 U2.18 22.48,40.77 v21.64,39.93 | 21.91,42.94 22.02,43.05 23.93,43.05 24.92,44.04 24.92,44.2 R5.2 24.99,44.2 25.45,44.65 v25.45,44.88 | v10.59,30.79 9.3,29.49 | 9.3,29.49 8.53,28.73 IC1.9 | J4.2 4.34,44.5 4.34,45.34 6.02,47.02 16.31,47.02 20.34,42.98 21.87,42.98 21.91,42.94 | J2.11 6.48,5.94 7.39,6.86 7.39,7.92 6.63,8.69 6.02,8.69 5.03,9.68 5.03,12.95 5.87,13.79 7.01,13.79 7.7,14.48 7.7,14.71 12.27,19.28 14.86,19.28 15.39,19.81 15.39,21.34 15.7,21.64 v15.7,23.55 | 9.3,29.49 v9.98,28.8
  Bottom 0.152: v10.59,30.79 11.43,30.79 20.57,39.93 v21.64,39.93 | v25.45,44.88 25.45,45.8 27.58,47.93 28.42,47.93 29.11,47.24 29.11,46.33 28.5,45.72 27.96,45.72 26.98,44.73 26.98,43.81 27.96,42.82 27.96,41.76 U1.2 | v15.7,23.55 15.24,23.55 v9.98,28.8
D5IO2  (via drill 0.3)
  Top 0.152: v24.38,31.77 23.16,30.56 R8.1 | v24.38,35.2 24.38,36.96 23.16,38.18 U2.17 | 3.01,32.27 2.59,32.69 2.59,33.6 3.2,34.21 5.11,34.21 6.02,33.3 8.69,33.3 v8.99,33.6 | 3.01,32.27 3.66,31.62 3.66,30.33 JP1.1 | J2.12 4.27,2.29 3.73,2.82 2.74,2.82 v1.29,4.27 | 3.01,32.27 v2.82,32.08
  Bottom 0.152: v24.38,31.77 v24.38,35.2 24.38,37.95 21.87,40.46 20.65,40.46 14.78,34.59 10.29,34.59 9.3,33.6 v8.99,33.6 | v1.29,4.27 1.29,12.12 1.52,12.34 1.52,30.79 v2.82,32.08
D6IO16  (via drill 0.3)
  Top 0.152: 25.57,47.51 25.07,47.02 17.53,47.02 v17.3,46.79 | 25.57,47.51 26.29,48.23 26.67,48.23 R7.1 | v8.61,43.66 7.16,42.22 U2.4 | v28.65,42.98 27.81,42.98 26.82,43.97 26.82,46.25 25.57,47.51
  Bottom 0.152: v17.3,46.79 11.73,46.79 v8.61,43.66 | v28.65,42.98 29.11,42.52 29.11,5.56 26.44,2.9 26.44,2.29 J5.14
EN
  Top 0.152: R1.2 4.04,41.91 4.88,41.91 7.09,44.12 U2.3
GND  (via drill 0.3)
  Top 0.305: C10.2 19.89,16.76 19.89,15.62 18.82,14.55 18.82,14.33 C9.- 18.67,14.17 18.21,13.72 16.31,13.72 15.32,14.71 15.16,14.71 C13.2 15.39,14.78 15.39,19.2 16.15,19.96 C15.- 16.23,20.12 16.23,21.72 16.99,22.48 C14.2 16.69,22.94 16.69,26.52 15.77,27.43 R10.1 15.77,27.58 15.77,28.27 19.2,31.7 19.2,33.83 19.43,34.06 21.03,34.06 22.02,33.07 | 22.33,31.47 23.09,31.47 R8.2 | 22.33,31.47 22.02,31.77 22.02,33.07 | 22.02,33.07 23.09,34.14 U2.15 | 22.25,30.33 20.04,28.12 C3.2 22.78,24.77 | 22.25,30.33 22.25,31.39 22.33,31.47 | 22.78,24.77 24.08,23.47 24.08,21.49 C11.2 | 22.78,24.77 21.64,23.62 21.64,18.52 U5.2 | IC1.8 14.1,28.65 14.1,27.51 IC1.7 14.1,26.21 IC1.6 14.25,26.14 15.01,26.14 v15.24,25.91 | J5.4 25.07,27.66 22.48,30.25 22.33,30.25 22.25,30.33 | R13.1 19.05,10.21 19.58,9.68 19.58,9.07 U4.3 19.58,8.91 19.58,8.46 20.04,8 U4.HEAT | U4.HEAT 20.57,8.38 20.57,8.99 U4.1 | U4.HEAT 18.06,7.62 17.37,6.93 C8.- 17.22,6.86 17.22,4.8 J8.5 17.3,5.11 18.21,5.11 18.67,4.65 19.28,4.65 J8.S6 19.2,4.5 19.2,1.98 J8.S5 19.13,1.83 17.22,1.83 16.99,1.6 J8.S4 16.84,1.52 14.94,1.52 J8.S3 14.78,1.6 14.55,1.83 12.8,1.83 J8.S2 | C5.1 13.11,6.71 13.11,5.18 12.57,4.65 J8.S1 | C7.1 11.81,10.59 11.81,10.29 10.67,9.14 C6.1 10.59,8.99 10.59,7.77 10.52,7.7 | U3.9 10.82,6.02 10.97,5.87 10.97,5.33 R12.1 11.12,5.26 11.81,4.57 12.34,4.57 J8.S1 | U3.3 10.06,6.71 10.74,6.71 U3.9 | 10.52,7.7 10.06,7.7 U3.1 | 10.52,7.7 10.82,7.39 U3.9 | U3.6 11.58,6.71 10.9,6.71 U3.9 | C4.1 11.96,1.14 J8.S2 | J8.S1 12.57,4.5 12.57,1.91 J8.S2 | J3.1 1.83,47.24 1.83,44.58 J4.1 1.83,44.42 2.29,43.97 2.29,41.38 1.6,40.69 1.6,40.46 C1.1 0.76,39.62 0.76,38.1 1.52,37.34 C2.1 1.6,36.96 1.6,22.78 3.66,20.73 3.66,20.12 JP1.5
  Bottom 0.305: v15.24,25.91 17.6,25.91 18.67,24.84 23.55,24.84 26.36,27.66 J5.4 26.29,27.74 24.99,29.03 24.99,41.07 | 24.99,41.07 24.99,43.36 27.96,46.33 27.96,46.79 U1.4 | J8.S2 11.81,0.99 5.71,0.99 5.33,1.37 J7.2 3.58,1.45 3.58,1.91 1.91,3.58 1.91,18.36 3.66,20.12 JP1.5 | J9.2 23.47,1.29 19.66,1.29 19.13,1.83 J8.S5 | 24.99,41.07 5.18,41.07 1.83,44.42 J4.1
LIPO_BAT  (via drill 0.3)
  Top 0.305: v18.44,6.17 19.05,6.17 U4.5 | v21.18,6.25 20.57,6.25 U4.8 | v13.03,21.57 13.03,22.63 13.41,23.01 13.49,23.01 IC1.4 | v20.19,15.01 20.19,12.57 22.17,10.59 22.17,9.91 22.86,9.22 R16.2 22.94,9.14 24.46,9.14 R14.2 24.08,9.07 24.08,5.49 23.55,4.95 23.55,3.81 J9.1
  Bottom 0.305: 21.11,6.17 v18.44,6.17 | 21.11,6.17 23.47,3.81 J9.1 | v21.18,6.25 21.11,6.17 | v13.03,21.57 13.64,21.57 v20.19,15.01
MISO
  Top 0.152: U2.10 12.04,32.77 12.04,37.19 8.15,41.07 6.02,41.07 4.57,39.62 4.57,38.18 3.2,36.8 2.74,36.8 1.98,36.04 1.98,26.9 3.66,25.22 JP1.3
  Bottom 0.152: J5.10 26.36,12.42 26.36,13.56 25.3,14.63 25.3,15.85 18.75,22.4 14.71,22.4 13.95,23.16 7.39,23.16 6.63,23.93 4.95,23.93 3.73,25.15 JP1.3
MOSI  (via drill 0.3)
  Top 0.152: v15.54,30.18 18.06,32.69 U2.13 | v12.72,28.65 11.28,27.2 v11.28,23.7 11.28,22.4 9.37,20.5 7.77,20.5 6.86,21.41 5.71,21.41 4.88,22.25 4.88,26.36 3.5,27.74 JP1.2 | v27.89,12.95 27.89,9.37 26.44,7.92 26.44,7.39 J5.12
  Bottom 0.152: v15.54,30.18 14.25,30.18 v12.72,28.65 | v27.89,12.95 27.89,15.47 27.05,16.31 25.3,16.31 18.9,22.71 14.86,22.71 14.1,23.47 11.51,23.47 v11.28,23.7
N$1
  Top 0.305: D1.+ 8.69,1.6 6.71,3.58 3.96,3.58 3.66,3.89 J7.1
N$2
  Top 0.152: R15.1 22.4,5.11 22.4,3.05 20.95,1.6 20.95,1.22 D3.+
N$3
  Top 0.152: U3.2 9.98,7.24 9.53,7.24 9.14,7.62 9.14,9.3 L1.1
N$4
  Top 0.152: R11.1 8.46,6.71 9.07,6.71 9.53,6.25 9.98,6.25 U3.4 10.06,6.17 10.06,5.33 R12.2
N$7
  Top 0.152: U4.2 20.12,9.07 20.12,9.83 20.5,10.21 R13.2
N$8
  Top 0.152: U4.7 20.12,6.17 20.12,5.41 20.88,4.65 20.88,2.74 D3.-
N$10
  Top 0.152: C11.1 24.16,19.89 24.16,16.54 24.99,15.7 24.99,11.2 24.46,10.67 R14.1
N$11
  Top 0.152: C12.1 16.76,17.07 17.14,17.07 18.75,18.67 19.81,18.67 20.04,18.9 20.04,20.57 20.57,21.11 U5.5 20.65,21.18 20.65,22.86 L2.2
NEG_SILK
  pour Top: 27.94,28.45 29.97,28.45 29.97,26.67 27.94,26.67
RST  (via drill 0.3)
  Top 0.152: R7.2 25.15,48.23 24.23,47.32 8,47.32 7.16,48.16 U2.1 7.09,48.16 5.26,48.16 4.34,47.24 J3.2 | C2.2 1.52,38.56 1.6,38.48 R2.2 3.2,38.48 3.2,39.47 v5.49,41.76 | v23.09,28.65 23.16,28.65 26.67,25.15 J5.5 | v13.72,41.76 v18.75,36.73
  Bottom 0.152: J3.2 4.34,47.24 5.49,46.1 v5.49,41.76 v13.72,41.76 | v23.09,28.65 23.09,31.77 23.16,31.85 23.16,32.31 v18.75,36.73
SCLK  (via drill 0.3)
  Top 0.152: v17.22,21.34 17.75,21.87 17.75,24.99 19.2,26.44 19.2,27.89 20.04,28.73 20.04,32.69 U2.14
  Bottom 0.152: JP1.4 3.5,22.63 4.72,21.41 6.71,21.41 7.39,22.1 13.72,22.1 14.48,21.34 v17.22,21.34 19.36,21.34 24.99,15.7 24.99,12.12 26.67,10.44 J5.11
SOL5V  (via drill 0.3)
  Top 0.305: 18.21,9.07 17.6,9.07 C8.+ 17.14,9.45 15.7,9.45 15.32,9.83 D2.- 15.24,9.91 v14.17,8.84 | 18.21,9.07 19.05,9.07 U4.4 | 18.21,9.07 18.21,10.67 18.52,10.97 21.11,10.97 21.34,10.74 21.34,9.37 22.4,8.31 22.48,8.31 23.24,7.54 R15.2 | D1.- 9.75,4.42 v9.91,4.57
  Bottom 0.305: v14.17,8.84 v9.91,4.57
USB5V
  Top 0.305: D2.+ 15.24,6.17 14.63,5.56 14.63,4.8 J8.1
Z
  Top 0.152: R9.2 15.7,24.31 14.94,23.55 14.94,23.16 14.17,22.4 IC1.3

### Text on the board
tPlace: RST | 3v | R3Mkr12F | Tx | Rx | 5V | 3V3 | + | + | Solar | LiPo
bPlace: c R3Mkr12F.tracker99.com
tRestrict: G